# EAGLE design Arduino-Fio (EAGLE 7.6.0)

## Sheet 1 of 2
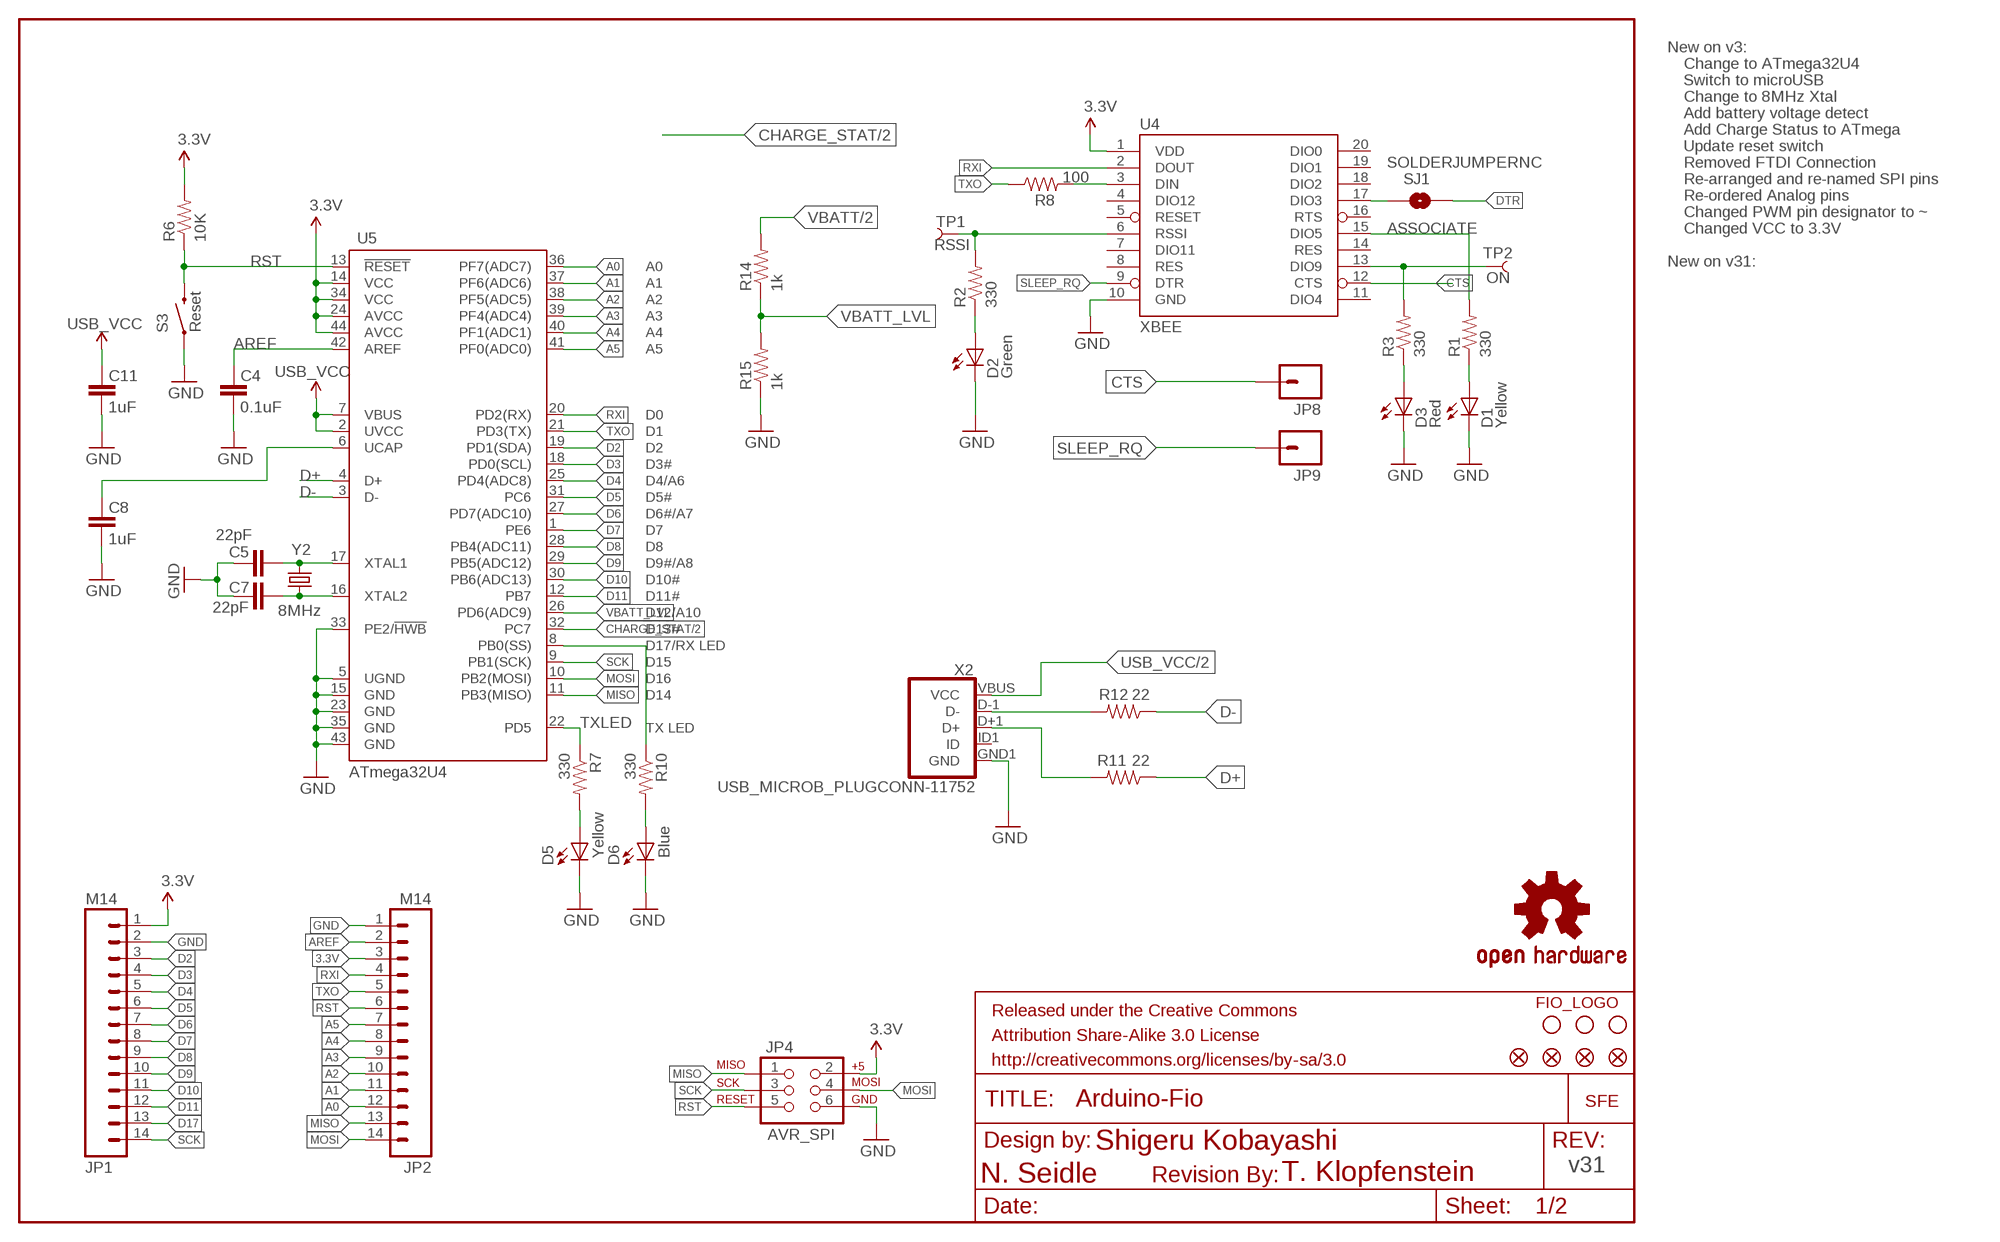
[diagram p0: schematic, sheet 1]

### Parts
C4  0.1uF  CAP0603-CAP  [0603-CAP]
C5  22pF  CAP0603-CAP  [0603-CAP]
C7  22pF  CAP0603-CAP  [0603-CAP]
C8  1uF  CAP0603-CAP  [0603-CAP]
C11  1uF  CAP0603-CAP  [0603-CAP]
D1  Yellow  LED0603  [LED-0603]
D2  Green  LED0603  [LED-0603]
D3  Red  LED0603  [LED-0603]
D5  Yellow  LED0603  [LED-0603]
D6  Blue  LED0603  [LED-0603]
FRAME1  FRAME-LETTER  [CREATIVE_COMMONS]
JP1  M14  [1X14]
JP2  M14  [1X14]
JP4  AVR_SPI  AVR_SPI_PRG_6PTH  [2X3]
JP5  STAND-OFF  [STAND-OFF]
JP8  M01PTH  [1X01]
JP9  M01PTH  [1X01]
JP10  FIDUCIALUFIDUCIAL  FIDUCIAL1X2  [FIDUCIAL-1X2]
JP11  FIDUCIALUFIDUCIAL  FIDUCIAL1X2  [FIDUCIAL-1X2]
JP12  FIDUCIALUFIDUCIAL  FIDUCIAL1X2  [FIDUCIAL-1X2]
JP13  FIDUCIALUFIDUCIAL  FIDUCIAL1X2  [FIDUCIAL-1X2]
JP16  STAND-OFF  [STAND-OFF]
JP17  STAND-OFF  [STAND-OFF]
LOGO1  OSHW-LOGOL  [OSHW-LOGO-L]
R1  330  RESISTOR0603-RES  [0603-RES]
R2  330  RESISTOR0603-RES  [0603-RES]
R3  330  RESISTOR0603-RES  [0603-RES]
R6  10K  RESISTOR0603-RES  [0603-RES]
R7  330  RESISTOR0603-RES  [0603-RES]
R8  100  RESISTOR0603-RES  [0603-RES]
R10  330  RESISTOR0603-RES  [0603-RES]
R11  22  RESISTOR0603-RES  [0603-RES]
R12  22  RESISTOR0603-RES  [0603-RES]
R14  1k  RESISTOR0603-RES  [0603-RES]
R15  1k  RESISTOR0603-RES  [0603-RES]
S3  Reset  SWITCH-MOMENTARY-2SMD  [TACTILE_SWITCH_SMD]
SJ1  SOLDERJUMPERNC  [SJ_2S]
TP1  RSSI  TEST-POINT3X5  [PAD.03X.05]
TP2  ON  TEST-POINT3X5  [PAD.03X.05]
U4  XBEE  XBEE-1B3  [XBEE-SMD]
U5  ATmega32U4  ATMEGA32U41:1  [QFN-44-NOPAD_1:1]
U$1  LOGO-SFENEW  [SFE-NEW-WEBLOGO]
U$2  REVISION  [REVISION]
U$6  FIO_LOGOV2  [FUNNEL_LOGO_BOTTOM_V2]
X2  USB_MICROB_PLUGCONN-11752  [USB-B-MICRO-SMD_V03]
Y2  8MHz  CRYSTAL5X3  [CRYSTAL-SMD-5X3]

### Nets
3.3V [vcc]: JP1.1 JP2.3 JP4.2 R6.2 U4.1(VDD) U5.14(VCC) U5.24(AVCC) U5.34(VCC) U5.44(AVCC) ; also sheet 2
A0: JP2.12 U5.36(PF7(ADC7))
A1: JP2.11 U5.37(PF6(ADC6))
A2: JP2.10 U5.38(PF5(ADC5))
A3: JP2.9 U5.39(PF4(ADC4))
A4: JP2.8 U5.40(PF1(ADC1))
A5: JP2.7 U5.41(PF0(ADC0))
AREF: C4.2 JP2.2 U5.42(AREF)
ASSOCIATE: R1.2 U4.15(DIO5)
CHARGE_STAT: U5.32(PC7) ; also sheet 2
CTS: JP8.1 U4.12(CTS)
D2: JP1.3 U5.19(PD1(SDA))
D3: JP1.4 U5.18(PD0(SCL))
D4: JP1.5 U5.25(PD4(ADC8))
D5: JP1.6 U5.31(PC6)
D6: JP1.7 U5.27(PD7(ADC10))
D7: JP1.8 U5.1(PE6)
D8: JP1.9 U5.28(PB4(ADC11))
D9: JP1.10 U5.29(PB5(ADC12))
D10: JP1.11 U5.30(PB6(ADC13))
D11: JP1.12 U5.12(PB7)
D17: JP1.13 R10.1 U5.8(PB0(SS))
D+: R11.1 U5.4(D+)
D-: R12.1 U5.3(D-)
DTR: SJ1.2
GND: C4.1 C5.2 C7.2 C8.1 C11.1 D1.C D2.C D3.C D5.C D6.C JP1.2 JP2.1 JP4.6 R15.1 S3.1 U4.10(GND) U5.5(UGND) U5.15(GND) U5.23(GND) U5.33(PE2/!HWB) U5.35(GND) U5.43(GND) X2.GND1(GND) ; also sheet 2
MISO: JP2.13 JP4.1 U5.11(PB3(MISO))
MOSI: JP2.14 JP4.4 U5.10(PB2(MOSI))
N$1: R3.2 TP2.P$1 U4.13(DIO9)
N$2: D1.A R1.1
N$3: D2.A R2.1
N$4: R2.2 TP1.P$1 U4.6(RSSI)
N$5: R11.2 X2.D+1(D+)
N$6: D3.A R3.1
N$7: R8.2 U4.3(DIN)
N$13: SJ1.1 U4.17(DIO3)
N$15: D5.A R7.2
N$16: C7.1 U5.16(XTAL2) Y2.1
N$17: C5.1 U5.17(XTAL1) Y2.3
N$19: D6.A R10.2
N$20: R12.2 X2.D-1(D-)
RST: JP2.6 JP4.5 R6.1 S3.3 U5.13(!RESET)
RXI: JP2.4 U4.2(DOUT) U5.20(PD2(RX))
SCK: JP1.14 JP4.3 U5.9(PB1(SCK))
SLEEP_RQ: JP9.1 U4.9(DTR)
TXLED: R7.1 U5.22(PD5)
TXO: JP2.5 R8.1 U5.21(PD3(TX))
UCAP: C8.2 U5.6(UCAP)
USB_VCC: C11.2 U5.2(UVCC) U5.7(VBUS) X2.VBUS(VCC) ; also sheet 2
VBATT: R14.2 ; also sheet 2
VBATT_LVL: R14.1 R15.2 U5.26(PD6(ADC9))
Unconnected: U4.4(DIO12) U4.5(RESET) U4.7(DIO11) U4.8(RES) U4.11(DIO4) U4.14(RES) U4.16(RTS) U4.18(DIO2) U4.19(DIO1) U4.20(DIO0) X2.ID1(ID)

### Notes on the sheet
- New on v3:
- Change to ATmega32U4
- Switch to microUSB
- Change to 8MHz Xtal
- Add battery voltage detect
- Add Charge Status to ATmega
- Update reset switch
- Removed FTDI Connection
- Re-arranged and re-named SPI pins
- Re-ordered Analog pins
- Changed PWM pin designator to ~
- Changed VCC to 3.3V
- New on v31:
- Shigeru Kobayashi
- v31
- N. Seidle | T. Klopfenstein

## Sheet 2 of 2
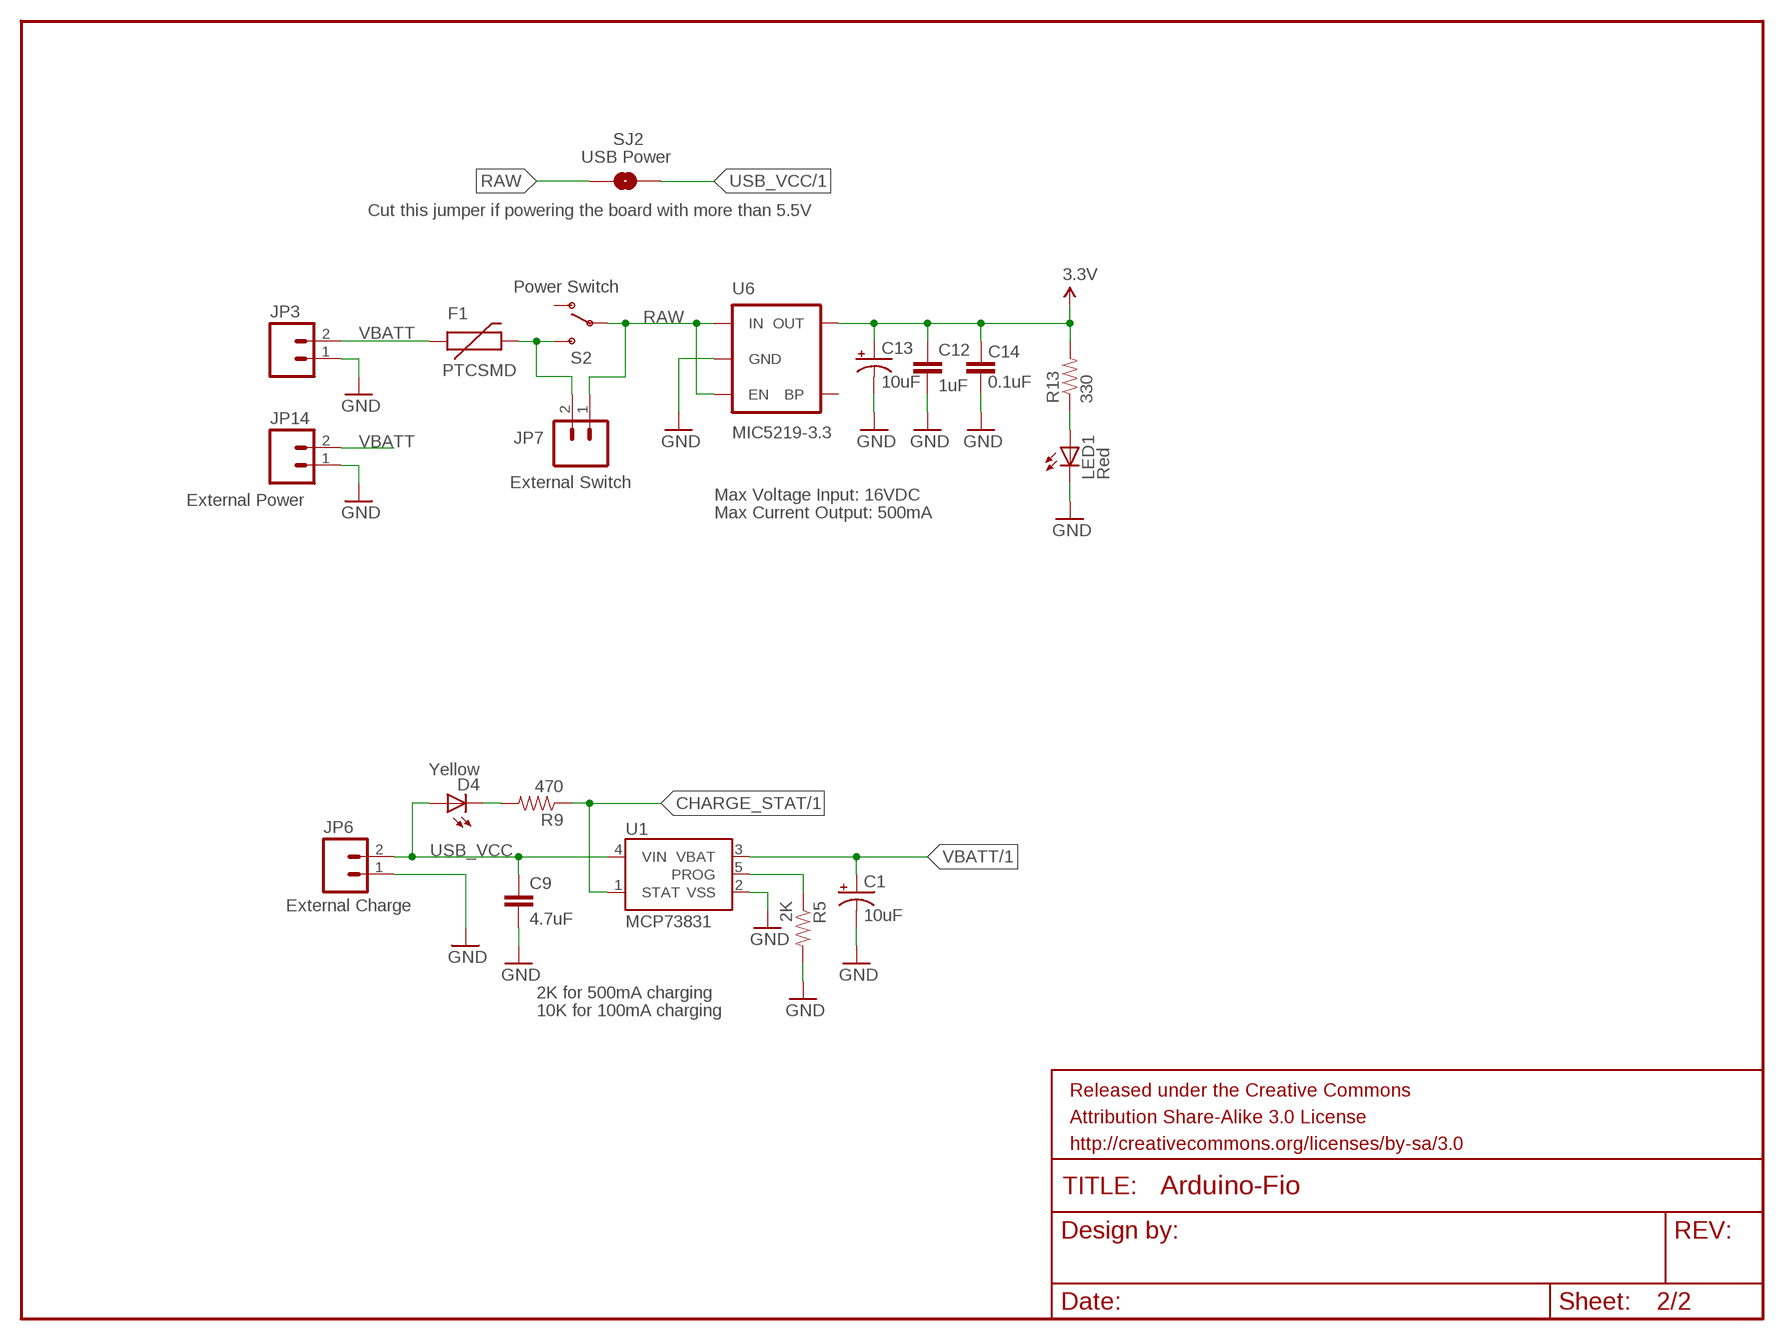
[diagram p1: schematic, sheet 2]

### Parts
C1  10uF  CAP_POL1206  [EIA3216]
C9  4.7uF  CAP0603-CAP  [0603-CAP]
C12  1uF  CAP0603-CAP  [0603-CAP]
C13  10uF  CAP_POL1206  [EIA3216]
C14  0.1uF  CAP0603-CAP  [0603-CAP]
D4  Yellow  LED0603  [LED-0603]
F1  PTCSMD  [PTC-1206]
FRAME2  FRAME-LETTER  [CREATIVE_COMMONS]
JP3  M02-JST-2MM-SMT  [JST-2-SMD]
JP6  External Charge  M02PTH  [1X02]
JP7  External Switch  M02PTH  [1X02]
JP14  External Power  M02PTH  [1X02]
LED1  Red  LED0603  [LED-0603]
R5  2K  RESISTOR0603-RES  [0603-RES]
R9  470  RESISTOR0603-RES  [0603-RES]
R13  330  RESISTOR0603-RES  [0603-RES]
S2  Power Switch  SWITCH-SPSTSMD  [AYZ0202]
SJ2  USB Power  SOLDERJUMPERTRACE  [SJ_2S-TRACE]
U1  MCP73831  [SOT23-5]
U6  MIC5219-3.3  V_REG_LDOSMD  [SOT23-5]

### Nets
3.3V [vcc]: C12.1 C13.A(+) C14.2 R13.2 U6.5(OUT) ; also sheet 1
CHARGE_STAT: R9.1 U1.1(STAT) ; also sheet 1
GND: C1.C(-) C9.2 C12.2 C13.C(-) C14.1 JP3.1 JP6.1 JP14.1 LED1.C R5.2 U1.2(VSS) U6.2(GND) ; also sheet 1
N$8: D4.C R9.2
N$9: F1.2 JP7.2 S2.3(S)
N$11: R5.1 U1.5(PROG)
N$38: LED1.A R13.1
RAW [vcc]: JP7.1 S2.2(P) SJ2.1 U6.1(IN) U6.3(EN)
USB_VCC: C9.1 D4.A JP6.2 SJ2.2 U1.4(VIN) ; also sheet 1
VBATT: C1.A(+) F1.1 JP3.2 JP14.2 U1.3(VBAT) ; also sheet 1
Unconnected: S2.1(O) U6.4(BP)

### Notes on the sheet
- Cut this jumper if powering the board with more than 5.5V
- Max Voltage Input: 16VDC
- Max Current Output: 500mA
- 2K for 500mA charging
- 10K for 100mA charging

## Library data of the parts
C1 C13 = SparkFun:CAP_POL: Capacitor Polarized These are standard SMD and PTH capacitors. Normally 10uF, 47uF, and 100uF in electrolytic and tantalum varieties. Always verify the external diameter of the through hole cap, it varies with capacity, voltage, and manufacturer. The EIA devices should be standard.
C4 C5 C7-C9 C11 C12 C14 = SparkFun-Capacitors:CAP: Capacitor Standard 0603 ceramic capacitor, and 0.1" leaded capacitor.
D1-D6 LED1 = SparkFun:LED: LEDs Standard schematic elements and footprints for 5mm, 3mm, 1206, and 0603 sized LEDs. 5mm - Spark Fun Electronics SKU : COM-00529 (and others)
F1 = SparkFun:PTC: Resettable Fuse PTC Resettable Fuse. Spark Fun Electronics SKU : COM-08357
FRAME1 FRAME2 = SparkFun-Aesthetics:FRAME-LETTER: Schematic Frame Standard 8.5x11 US Letter frame
JP1 JP2 = SparkFun:M14: Header 14 Standard 14-pin 0.1" header. Use with straight break away headers (SKU : PRT-00116), right angle break away headers (PRT-00553), swiss pins (PRT-00743), machine pins (PRT-00117), and female headers (PRT-00115).
JP3 JP6 JP7 JP14 = SparkFun:M02: Header 2 Standard 2-pin 0.1" header. Use with straight break away headers (SKU : PRT-00116), right angle break away headers (PRT-00553), swiss pins (PRT-00743), machine pins (PRT-00117), and female headers (PRT-00115). Molex polarized connector foot print use with SKU : PRT-08233 with associated crimp pins and housings.
JP4 = SparkFun:AVR_SPI_PRG_6: AVR ISP 6 Pin This is the reduced ISP connector for AVR programming. Common on Arduino. This footprint will take up less PCB space and can be used with a 10-pin to 6-pin adapter such as SKU: BOB-08508
JP5 JP16 JP17 = SparkFun:STAND-OFF: Stand Off This is the mechanical footprint for a #4 phillips button head screw. Use the keepout ring to avoid running the screw head into surrounding components. SKU : PRT-00447
JP8 JP9 = SparkFun:M01: Header 1 Standard 1-pin 0.1" header. Use with straight break away headers (SKU : PRT-00116), right angle break away headers (PRT-00553), swiss pins (PRT-00743), machine pins (PRT-00117), and female headers (PRT-00115).
JP10-JP13 = SparkFun:FIDUCIAL: Fiducial Alignment Points Various fiducial points for machine vision alignment.
LOGO1 = SparkFun-Aesthetics:OSHW-LOGO: Open Source Hardware Logo This logo indicates the piece of hardware it is found on incorporates a OSHW license and/or adheres to the definition of open source hardware found here: http://freedomdefined.org/OSHW
R1-R3 R5-R15 = SparkFun-Resistors:RESISTOR: Resistor Basic schematic elements and footprints for 0603, 1206, and PTH resistors.
S2 = SparkFun:SWITCH-SPST: SPST Switch Simple slide switch. Spark Fun Electronics SKU : COM-00102
S3 = SparkFun:SWITCH-MOMENTARY-2
SJ1 SJ2 = SparkFun:SOLDERJUMPER: Solder Jumper Standard SMD solder jumper. Used to automate production. Two varients : Normally Open and Normally Closed are the same, but have different paste layers. NC will have a large amount of paste and should jumper during reflow.
TP1 TP2 = SparkFun:TEST-POINT
U1 = SparkFun:MCP73831: Microchip's MCP73831 Miniature single cell, fully integrated Li-Ion, Li-polymer charge management controller http://ww1.microchip.com/downloads/en/DeviceDoc/21984a.pdf
U4 = SparkFun:XBEE-1
U5 = SparkFun-IC-Microcontroller:ATMEGA32U4: Atmel MCU, 32KByte Atmel 44-pin 8-bit Microcontroller with 32KBytes of ISP Flash and USB Controller Datasheet <http://cdn.sparkfun.com/datasheets/Dev/Arduino/Boards/ATMega32U4.pdf> SparkFun Products LilyPad Arduino USB - ATmega32U4 Board <https://www.sparkfun.com/products/12049> (DEV-12049) Pro Micro - 5V/16MHz <https://www.sparkfun.com/products/12640> (DEV-12640) Pro Micro - 3.3V/8MHz <https://www.sparkfun.com/products/12587> (DEV-12587) Fio v3 - ATmega32U4 <https://www.sparkfun.com/products/11520> (DEV-11520) Qduino Mini <https://www.sparkfun.com/products/13614> (DEV-13614) Makey Makey - Standard Kit <https://www.sparkfun.com/products/11511> (WIG-11511) Makey Makey Deluxe Kit <https://www.sparkfun.com/products/11519> (WIG-11519); PROD_ID: IC-10828; VALUE: 32U4
U6 = SparkFun:V_REG_LDO: Voltage Regulator LDO Standard 150mA LDO voltage regulator in SOT-23 layout. Micrel part MIC5205. BP (by-pass) pin is used to lower output noise with 470pF cap.
U$1 = SparkFun:LOGO-SFE: Spark Fun Electronics PCB Logo This is the standard Spark Fun Electronics PCB logo.
U$2 = SparkFun-Aesthetics:REVISION
U$6 = SparkFun:FIO_LOGO
X2 = SparkFun-Connectors:USB_MICROB_PLUG: USB Micro-B Plug Comes in a variety of packages. Check out Hirose's ZX-x0 line: http://www.hirose.co.jp/cataloge_hp/e24200011.pdf; PROD_ID: CONN-11752
Y2 = SparkFun:CRYSTAL: Crystals Various standard crystals. Proven footprints. Spark Fun Electronics SKU : COM-00534

## Net classes
0 Default: width 0.203 mm
2 LEDPower: width 0.203 mm
3 ButtonSignal: width 0.203 mm

## Board
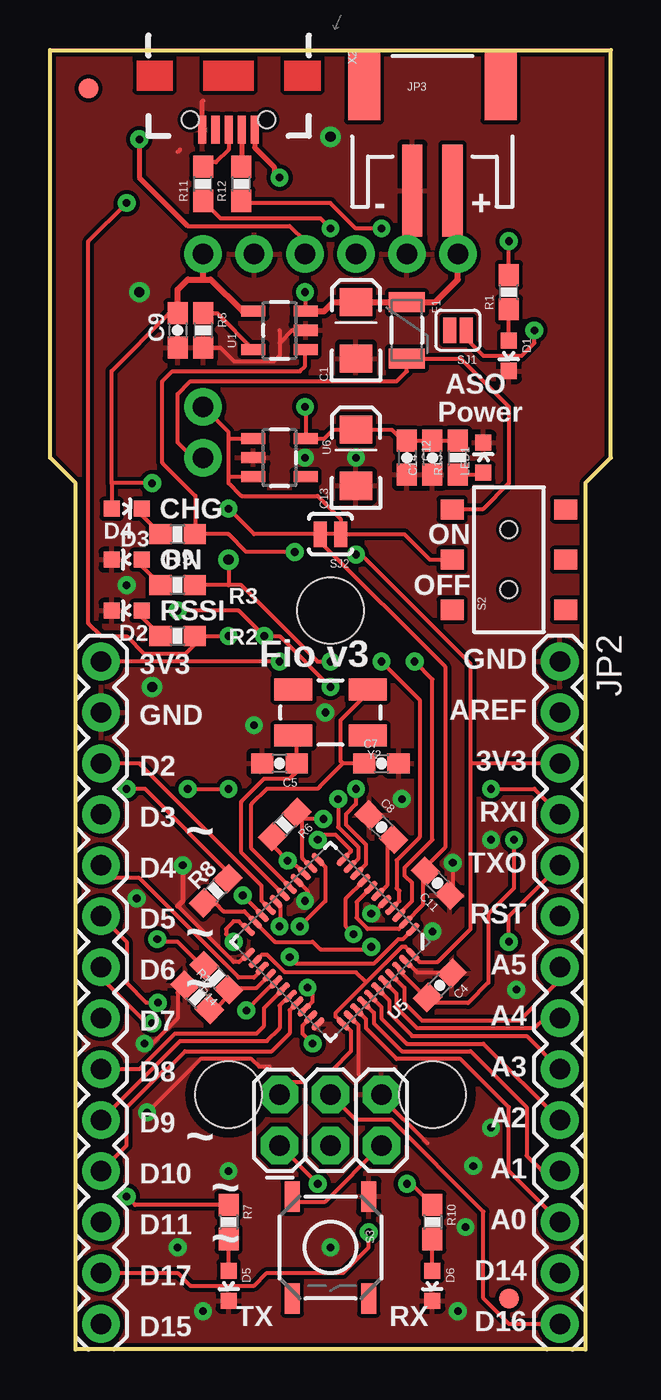
[diagram p2: board, top side]
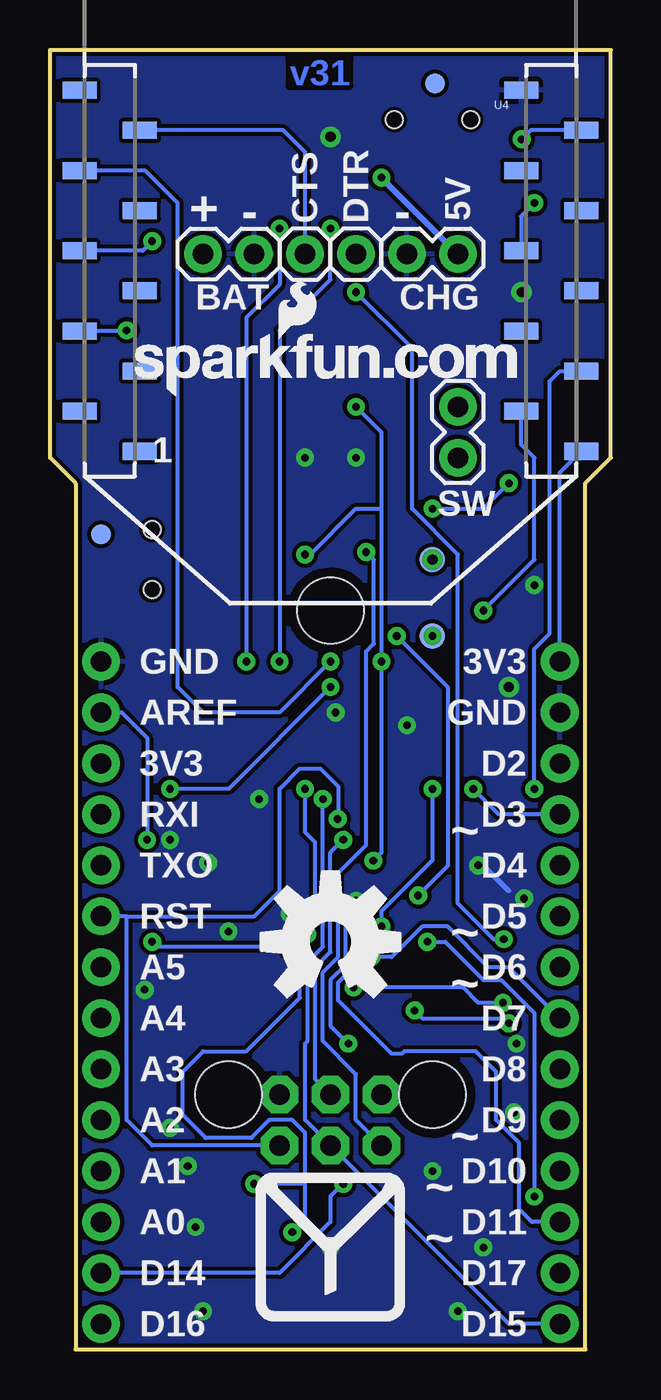
[diagram p3: board, bottom side, seen from below]

Size 27.94 x 64.77 mm. Coordinates in mm from the lower left corner, seen from the top.
Outline: 26.67,43.18 26.67,0 1.27,0 1.27,43.18 0,44.45 0,64.77 27.94,64.77 27.94,44.45 26.67,43.18
Copper layers (1*16): Top 0.035mm / dielectric 1.5mm / Bottom 0.035mm
Design rules "SparkFun *": minimum track width 7mil, minimum drill 15mil, track to track 5mil, track to pad 5mil, pad to pad 5mil, via to via 5mil, smd to smd 5mil, copper to edge 8mil, drill to drill 8mil, minimum pad ring 12mil, minimum via ring 10mil, stop-mask expansion 4mil, vias tented up to drill 20mil, thermal gap 10mil

### Footprints (pad centres in the part's own frame; a part is rotated, then mirrored left to right if it is on the bottom)
EIA3216 = smd 1.4 x 1.6: A 1.4,0; C -1.4,0
0603-CAP = smd 1.1 x 1: 1 -0.85,0; 2 0.85,0
LED-0603 = smd 0.8 x 0.8: A 0,-0.75; C 0,0.75
PTC-1206 = smd 1 x 1.8: 1 -1.4,0; 2 1.4,0
1X14 = drill 1.016 pad 1.88: 1 0,0; 2 2.54,0; 3 5.08,0; 4 7.62,0; 5 10.16,0; 6 12.7,0; 7 15.24,0; 8 17.78,0; 9 20.32,0; 10 22.86,0; 11 25.4,0; 12 27.94,0; 13 30.48,0; 14 33.02,0
JST-2-SMD = smd 1 x 4.6: 1 -1,-3.7; 2 1,-3.7 | smd 1.6 x 3.4: NC1 -3.4,1.5; NC2 3.4,1.5
2X3 = drill 1.016 pad 1.88 octagon: 1 0,0; 2 0,2.54; 3 2.54,0; 4 2.54,2.54; 5 5.08,0; 6 5.08,2.54
STAND-OFF = hole 3.302: 0,0
1X02 = drill 1.016 pad 1.88: 1 0,0; 2 2.54,0
1X01 = drill 1.016 pad 1.88: 1 0,0
FIDUCIAL-1X2 = smd 1 x 1: 1 0,0
0603-RES = smd 1.1 x 1: 1 -0.85,0; 2 0.85,0
AYZ0202 = smd 1 x 1.15: 1 -2.5,2.825; 2 0,2.825; 3 2.5,2.825; 4 -2.5,-2.825; 5 0,-2.825; 6 2.5,-2.825 | hole 0.85: 1.5,0; -1.5,0
TACTILE_SWITCH_SMD = smd 1.524 x 0.762: 1 -2.54,1.905; 2 2.54,1.905; 3 -2.54,-1.905; 4 2.54,-1.905
SJ_2S = smd 0.635 x 1.27: 1 -0.412,0; 2 0.412,0
SJ_2S-TRACE = smd 0.635 x 1.27: 1 -0.508,0; 2 0.508,0
PAD.03X.05 = smd 1.27 x 1.27: P$1 0,0
SOT23-5 = smd 0.55 x 1.2: 1 -0.95,-1.3; 2 0,-1.3; 3 0.95,-1.3; 4 0.95,1.3; 5 -0.95,1.3
XBEE-SMD = smd 1.7 x 0.85: 1 -12.5,20; 2 -9.5,18; 3 -12.5,16; 4 -9.5,14; 5 -12.5,12; 6 -9.5,10; 7 -12.5,8; 8 -9.5,6; 9 -12.5,4; 10 -9.5,2; 11 12.5,2; 12 9.5,4; 13 12.5,6; 14 9.5,8; 15 12.5,10; 16 9.5,12; 17 12.5,14; 18 9.5,16; 19 12.5,18; 20 9.5,20
QFN-44-NOPAD_1:1 = smd 0.8 x 0.3: 1 -3.337,2.458; 2 -3.337,1.958; 3 -3.337,1.479; 4 -3.337,0.979; 5 -3.337,0.5; 6 -3.337,0; 7 -3.337,-0.5; 8 -3.337,-0.979; 9 -3.337,-1.479; 10 -3.337,-1.958; 11 -3.337,-2.458; 23 3.337,-2.458; 24 3.337,-1.958; 25 3.337,-1.479; 26 3.337,-0.979; 27 3.337,-0.5; 28 3.337,0; 29 3.337,0.5; 30 3.337,0.979; 31 3.337,1.479; 32 3.337,1.958; 33 3.337,2.458 | smd 0.3 x 0.8: 12 -2.458,-3.337; 13 -1.958,-3.337; 14 -1.479,-3.337; 15 -0.979,-3.337; 16 -0.5,-3.337; 17 0,-3.337; 18 0.5,-3.337; 19 0.979,-3.337; 20 1.479,-3.337; 21 1.958,-3.337; 22 2.458,-3.337; 34 2.458,3.337; 35 1.958,3.337; 36 1.479,3.337; 37 0.979,3.337; 38 0.5,3.337; 39 0,3.337; 40 -0.5,3.337; 41 -0.979,3.337; 42 -1.479,3.337; 43 -1.958,3.337; 44 -2.458,3.337
USB-B-MICRO-SMD_V03 = smd 1.4 x 0.4: D+1 2.7,0; D-1 2.7,0.65; GND1 2.7,-1.3; ID1 2.7,-0.65; VBUS 2.7,1.3 | hole 0.85: 2.2,1.9; 2.2,-1.9
CRYSTAL-SMD-5X3 = smd 1.9 x 1.1: 1 -1.85,-1.15; 2 1.85,-1.15; 3 1.85,1.15; 4 -1.85,1.15

### Placement (x,y rotation side)
C1  15.24,50.8 90 top
C4  19.41,18.14 225 top
C5  11.43,29.21 180 top
C7  16.51,29.21 0 top
C8  16.51,26.04 315 top
C9  6.35,50.8 270 top
C11  19.3,23.24 135 top
C12  17.78,44.45 270 top
C13  15.24,44.45 90 top
C14  19.05,44.45 90 top
D1  22.86,49.53 180 top
D2  3.81,36.83 90 top
D3  3.81,39.37 90 top
D4  3.81,41.91 270 top
D5  8.89,3.17 180 top
D6  19.05,3.17 180 top
F1  17.78,50.8 270 top
FRAME1  1.8,-11.43 0 top  (outside the outline)
FRAME2  1.91,-11.43 0 top  (outside the outline)
JP1  2.54,34.29 270 top
JP2  25.4,34.29 270 top
JP3  19.05,61.47 0 top
JP4  11.43,10.16 0 top
JP5  8.89,12.7 0 top
JP6  10.16,54.61 0 bottom
JP7  7.62,46.99 270 bottom
JP8  15.24,54.61 0 bottom
JP9  12.7,54.61 0 bottom
JP10  22.86,2.54 0 top
JP11  1.91,62.87 0 top
JP12  8.76,63.12 0 bottom
JP13  25.4,40.64 0 bottom
JP14  17.78,54.61 180 bottom
JP16  13.97,36.83 0 top
JP17  19.05,12.7 0 top
LED1  21.59,44.45 0 top
LOGO1  13.97,20.32 0 bottom
R1  22.86,52.7 90 top
R2  6.35,35.56 0 top
R3  6.35,38.1 0 top
R5  7.62,50.8 270 top
R6  11.68,26.16 225 top
R7  8.89,6.35 270 top
R8  8.26,22.86 45 top
R9  6.35,40.64 180 top
R10  19.05,6.35 270 top
R11  7.62,58.1 90 top
R12  9.53,58.1 90 top
R13  20.32,44.45 90 top
R14  8.29,18.53 135 top
R15  7.33,17.55 315 top
S2  22.86,39.37 90 top
S3  13.97,5.08 270 top
SJ1  20.32,50.8 180 top
SJ2  13.97,40.64 180 top
TP1  8.89,35.56 0 bottom
TP2  8.89,39.37 0 bottom
U1  11.43,50.8 90 top
U4  13.97,64.77 180 bottom
U5  13.97,20.32 225 top
U6  11.43,44.45 270 top
U$1  23.75,47.5 0 bottom
U$2  13.97,-15.24 0 top  (outside the outline)
U$6  13.97,5.08 0 top
X2  8.89,63.5 270 top
Y2  13.97,31.75 180 top

### Tracks (layer width: path | path; a pad name or v marks a point on that pad's centre or on a via)
3.3V  (via drill 0.38)
  Top 0.203: R13.2 C14.2 C12.1 17.58,45.3 17.03,45.85 C13.A 14.1,45.85 13.65,45.4 U6.5 12.73,46.96 v12.7,46.99 | v11.43,34.29 JP1.1 | JP4.2 12.06,13.34 12.7,13.34 13.33,13.97 14.1,13.97 14.99,14.86 14.99,15.88 14.73,16.13 14.62,16.13 14.59,16.16 U5.34 14.22,16.59 14.22,16.76 15.75,18.29 | 16.65,19.19 17.53,20.07 17.7,20.07 U5.44 18.07,19.65 18.41,19.3 19.3,19.3 20.95,20.95 20.95,29.21 | 16.65,19.19 | 15.75,18.29 16.65,19.19 | 15.75,18.29 15.24,18.8 11.68,18.8 10.79,19.68 10.57,19.68 U5.24 | U5.14 12.02,24.36 v11.84,24.36 11.08,25.11 R6.2 | v15.24,39.62 15.49,39.62 20.95,34.16 20.95,29.21 | JP2.3 20.95,29.21
  Bottom 0.203: JP1.1 2.54,43.7 U4.1 | v12.7,46.99 11.43,45.72 11.43,41.91 | 11.43,41.91 v11.43,34.29 11.43,24.77 v11.84,24.36 | v15.24,39.62 14.99,39.62 12.7,41.91 11.43,41.91
A0
  Top 0.203: JP2.12 22.86,8.89 22.86,12.06 20.45,14.48 17.27,14.48 15.75,16 15.75,16.45 U5.36
A1
  Top 0.203: JP2.11 24.51,8.89 23.75,9.65 23.75,12.06 20.95,14.86 17.53,14.86 16.13,16.26 16.13,16.78 U5.37
A2
  Top 0.203: JP2.10 21.59,15.24 17.78,15.24 16.51,16.51 16.51,17.07 U5.38 | U5.38
A3
  Top 0.203: JP2.9 23.75,15.62 18.03,15.62 16.89,16.76 16.89,17.4 U5.39 | U5.39
A4
  Top 0.203: JP2.8 24.64,16.51 24.13,16 18.29,16 17.27,17.02 17.27,17.73 U5.40 | U5.40
A5
  Top 0.203: U5.41 17.65,18.02 17.65,17.27 18.54,16.38 23.37,16.38 25.4,18.41 JP2.7
AREF  (via drill 0.38)
  Top 0.203: U5.42 17.38,18.89 18.77,17.5 C4.2 19.09,17.27 20.83,17.27 21.84,18.29 21.84,21.72 23.11,22.99 v23.11,25.4
  Bottom 0.203: JP2.2 24.38,31.75 23.11,30.48 v23.11,25.4
ASSOCIATE  (via drill 0.38)
  Top 0.203: R1.2 v22.86,55.24
  Bottom 0.203: U4.15 23.34,54.77 v22.86,55.24
CHARGE_STAT  (via drill 0.38)
  Top 0.203: U5.32 12.99,16.52 12.96,16.52 12.57,16.13 12.57,15.75 v13.08,15.24 | v12.19,39.75 9.78,39.75 8.89,40.64 R9.1 7.24,40.68 7.24,42.55 5.59,44.2 5.59,48.26 6.1,48.77 12.45,48.77 12.7,49.02 12.7,49.82 U1.1
  Bottom 0.203: v13.08,15.24 13.97,16.13 13.97,18.41 13.21,19.18 13.21,21.97 13.59,22.35 13.59,23.75 12.19,25.15 12.19,34.8 11.81,35.18 11.81,39.37 v12.19,39.75
CTS
  Bottom 0.203: U4.12 16.32,60.77 15.24,59.69 JP8.1
D2
  Top 0.203: JP1.3 4.45,29.21 10.54,23.11 10.54,22.36 U5.19
D3  (via drill 0.38)
  Top 0.203: v6.86,27.94 v8.89,27.94 | U5.18 11.33,22.33 | U5.18 11.34,22.33 | 11.47,21.4 11.43,21.36 v11.43,21.08 11.47,21.12 11.47,22.11 U5.18
  Bottom 0.203: v6.86,27.94 5.59,26.67 JP1.4 | v8.89,27.94 8.89,24.38 11.43,21.84 v11.43,21.08
D4
  Top 0.203: U5.25 10.56,18.95 10.16,18.54 9.4,18.54 4.45,23.5 3.17,23.5 JP1.5
D5  (via drill 0.38)
  Top 0.203: 12.95,17.91 v12.83,18.03 13.08,17.78 13.08,17.34 U5.31 | JP1.6 3.81,20.32 3.81,18.26 4.79,17.28 v5.37,17.28
  Bottom 0.203: v5.37,17.28 6.61,17.28 7.37,18.03 v12.83,18.03
D6  (via drill 0.38 pad 0.41)
  Top 0.203: U5.27 11.2,18.31 v9.78,16.89 | v5.08,16.26 4.81,16.26 2.57,18.5 2.57,19.02 JP1.7
  Bottom 0.203: 5.33,16.38 5.21,16.38 v5.08,16.26 5.33,16.51 9.4,16.51 v9.78,16.89
D7  (via drill 0.38)
  Top 0.203: v11.94,19.56 12.24,19.25 16.15,19.25 17.35,20.45 17.57,20.45 U5.1
  Bottom 0.203: JP1.8 5.08,19.05 6.1,19.05 8.13,21.08 9.4,21.08 10.92,19.56 v11.94,19.56
D8
  Top 0.203: JP1.9 4.45,13.97 6.22,15.75 10.29,15.75 10.67,16.13 10.67,17.02 U5.28
D9
  Top 0.203: U5.29 11.89,17.61 11.43,17.14 11.43,16 10.79,15.37 6.48,15.37 JP1.10
D10
  Top 0.203: JP1.11 3.81,10.16 3.81,12.06 5.71,13.97 5.84,13.97 6.73,14.86 11.05,14.86 11.94,15.75 11.94,16.9 U5.30
D11  (via drill 0.38)
  Top 0.203: v12.45,21.08 13.72,22.35 13.72,24.05 U5.12
  Bottom 0.203: JP1.12 3.94,6.35 4.57,6.99 4.57,10.29 5.71,11.43 5.71,13.84 6.73,14.86 10.29,14.86 10.41,14.73 10.92,14.73 13.59,17.4 13.59,18.29 12.7,19.18 12.7,20.83 v12.45,21.08
D17  (via drill 0.38)
  Top 0.203: v15.11,20.7 14.73,21.08 14.73,22.48 15.67,23.41 15.67,23.4 U5.8 | JP1.13 6.35,3.81 6.98,3.17 10.16,3.17 10.79,3.81 14.61,3.81 15.88,5.08 v15.88,5.84 | v17.78,8.26 18,8.26 R10.1
  Bottom 0.203: 15.24,8.26 15.24,10.79 15.88,11.43 17.02,11.43 17.91,10.54 20.19,10.54 21.34,11.68 21.34,13.84 20.32,14.86 18.16,14.86 15.49,17.53 15.49,19.56 15.24,19.81 15.24,20.57 v15.11,20.7 | 15.24,8.26 v17.78,8.26 | v15.88,5.84 15.75,5.84 15.24,6.35 15.24,8.26
D+  (via drill 0.38)
  Top 0.203: v16.51,34.29 18.41,32.38 18.41,25.53 17.27,24.38 17.27,22.99 17.4,22.86 17.4,22.35 17.03,21.99 U5.4 | v13.97,55.88 13.46,56.39 8.48,56.39 R11.1
  Bottom 0.203: v13.97,55.88 13.97,53.34 16.51,50.8 v16.51,34.29
D-  (via drill 0.38 pad 0.41)
  Top 0.203: U5.3 17.38,21.69 18.03,22.35 18.03,23.24 17.65,23.62 17.65,24 19.05,25.4 19.05,33.4 v18.16,34.29 | v16.51,55.88 15.24,55.88 13.97,57.15 9.63,57.15 R12.1
  Bottom 0.203: v16.51,55.88 16.51,53.09 18.16,51.44 v18.16,34.29
GND  (via drill 0.38, 0.38 pad 0.41, 0.51)
  Top 0.203: 6.35,22.1 9.14,19.3 9.42,19.3 9.81,19.7 U5.23 | 15.37,13.72 15.37,16.15 U5.35 | JP4.6 16.51,12.57 18.8,10.29 | 10.92,14.1 10.41,14.1 10.03,14.48 7.49,14.48 v4.83,11.81 | U5.5 16.07,21.72 v16,21.72 | 20.07,18.8 C4.1 19.97,18.8 18.29,18.8 17.74,19.34 U5.43 | 6.73,18.67 R15.1 6.35,17.78 6.35,16.51 5.08,15.24 v4.7,15.24 | 19.94,22.67 C11.1 20.07,22.8 v20.07,24.26 | U1.2 12.06,50.8 11.43,50.16 | U5.15 12.83,22.85 12.83,22.48 v12.7,22.35 | R5.2 8.47,49.95 9.14,49.28 11.18,49.28 11.43,49.53 11.43,50.8 | 6.48,59.82 6.35,59.69
  Top 0.254: X2.GND1 7.59,62.2 7.62,62.23 | v6.6,24.13 6.6,22.35 6.35,22.1
  Bottom 0.254: v6.6,24.13 6.35,24.13 5.08,22.86
  other vias: 17.53,27.43 13.97,5.08 20.32,1.91 7.62,1.91 21.97,11.05 23.23,17.93 19.05,20.83 15.24,44.45 12.7,44.45 3.81,38.1 13.72,31.75 10.16,31.11 20.7,6.1 8.89,8.89 6.35,5.08 21.08,9.14 4.32,22.48 13.97,60.45 4.45,52.7 5.08,33.02 21.97,25.4
  pour Top (isolate 0.203): 0,64.77 27.94,64.77 27.94,0 0,0
  pour Bottom (isolate 0.203): 0,64.77 27.94,64.77 27.94,0 0,0
MISO  (via drill 0.38)
  Top 0.203: U5.11 14.99,24.81 14.99,24.89 14.22,25.65 13.59,25.65 v13.33,25.4 | JP4.1 v13.33,8.26
  Bottom 0.203: JP4.1 12.7,11.43 12.7,13.72 14.35,15.37 14.35,18.8 13.59,19.56 13.59,21.72 13.97,22.1 13.97,24.77 v13.33,25.4 | JP2.13 16.51,3.81 13.97,6.35 13.97,7.62 v13.33,8.26
MOSI  (via drill 0.38)
  Top 0.203: JP4.4 15.24,11.43 17.02,11.43 21.59,6.86 21.59,2.54 22.86,1.27 JP2.14 | v14.35,27.43 14.35,26.04 15.37,25.02 15.37,24.49 U5.10
  Bottom 0.203: v14.35,27.43 14.35,21.84 13.97,21.46 13.97,19.81 14.73,19.05 14.73,13.46 JP4.4
N$1  (via drill 0.38, 0.51)
  Top 0.203: v13.97,34.29 13.33,34.29 9.53,38.1 8.89,38.1 | 8.89,38.1 R3.2 | TP2.P$1 8.89,38.1
  Bottom 0.203: U4.13 23.21,58.77 21.59,57.15 21.59,33.02 20.32,31.75 16.51,31.75 v13.97,34.29
  other vias: 8.89,39.37
N$2
  Top 0.203: D1.A R1.1
N$3
  Top 0.203: D2.A 4.56,36.5 R2.1
N$4  (via drill 0.38)
  Top 0.203: TP1.P$1 R2.2 7.2,35.14 6.73,34.67 4.7,34.67 3.81,35.56 2.54,35.56 1.91,36.2 1.91,55.24 v3.81,57.15
  Bottom 0.203: U4.6 4.47,56.49 v3.81,57.15
  other vias: 8.89,35.56
N$5
  Top 0.203: X2.D+1 8.89,59.82 8.26,59.18 7.85,59.18 R11.2
N$6
  Top 0.203: D3.A 4.56,39.04 R3.1
N$7  (via drill 0.38)
  Top 0.203: v3.81,27.94 4.73,27.94 8.86,23.81 R8.2
  Bottom 0.203: v3.81,27.94 3.81,34.92 3.05,35.69 3.05,48.26 2.54,48.77 U4.3
N$8
  Top 0.203: D4.C 4.56,41.58 R9.2
N$9
  Top 0.203: S2.3 21.55,41.87 22.86,43.18 22.86,46.99 20.45,49.4 F1.2 17.78,48.77 17.27,48.26 6.98,48.26 6.35,47.62 6.35,45.21 7.11,44.45 JP7.2
N$11
  Top 0.203: R5.1 8.33,51.65 U1.5
N$13  (via drill 0.38)
  Top 0.203: SJ1.1 20.73,50.39 21.59,49.53 23.5,49.53 24.13,50.16 v24.13,50.8
  Bottom 0.203: v24.13,50.8 24.1,50.77 U4.17
N$15
  Top 0.203: D5.A R7.2
N$16
  Top 0.203: C7.1 14.59,29.21 | 14.59,29.21 13.45,28.07 13.45,28.05 13.33,27.94 10.79,27.94 10.03,27.18 10.03,24.96 U5.16 | 14.59,29.21 14.48,29.32 14.48,31.37 15.82,32.71 Y2.1 15.82,32.46 | U5.16
N$17
  Top 0.203: Y2.3 12.28,30.44 C5.1 12.28,28.79 11.94,28.45 10.67,28.45 9.53,27.3 9.53,24.77 U5.17 | U5.17
N$19
  Top 0.203: D6.A R10.2
N$20
  Top 0.203: 9.54,58.97 R12.2
  Top 0.254: X2.D-1 9.54,58.97
N$38
  Top 0.203: 21.49,43.8 LED1.A 21.49,43.6 R13.1
RAW
  Top 0.203: S2.2 18.92,39.37 17.65,40.64 SJ2.1 14.48,41.4 13.33,42.55 9.53,42.55 8.89,43.18 8.89,43.56 | 8.89,43.56 8.89,45.47 | 8.89,45.47 8.89,45.72 JP7.1 | U6.1 8.96,45.4 8.89,45.47 | U6.3 8.95,43.5 8.89,43.56
RST  (via drill 0.38)
  Top 0.203: U5.13 12.57,24.49 12.57,26.48 | 12.57,26.48 R6.1 | 12.57,26.48 12.57,26.54 | 12.57,26.48 13.58,26.48 v13.61,26.44 | 12.32,7.37 13.72,7.37 JP4.5
  Top 0.254: 12.32,7.37 S3.3
  Bottom 0.203: 24.13,21.59 JP2.6 | 24.13,21.59 17.78,21.59 16.51,22.86 16.51,27.94 15.49,28.96 14.48,28.96 13.59,28.07 13.59,26.47 v13.61,26.44 | 24.13,21.59 24.13,11.43 22.86,10.16 JP4.5
RXI  (via drill 0.38)
  Top 0.203: JP2.4 24.13,27.94 v21.97,27.94 | v6.35,36.83 9.4,36.83 v10.67,35.56 11.43,35.56 v13.97,33.02 | U5.20 10.56,21.67 v9.6,22.63
  Bottom 0.203: U4.2 4.47,45.11 3.81,44.45 3.81,39.37 v6.35,36.83 | v21.97,27.94 19.05,27.94 v13.97,33.02 | v10.67,35.56 8.13,33.02 8.13,24.11 v9.6,22.63
SCK  (via drill 0.38)
  Top 0.203: v15.24,27.94 15.24,27.18 14.73,26.67 14.73,26.16 15.75,25.15 15.75,24.19 U5.9
  Bottom 0.203: JP1.14 5.08,1.27 JP4.3 15.24,11.43 15.24,15.24 15.11,15.37 15.11,19.3 14.35,20.07 14.35,21.21 14.73,21.59 14.73,25.27 15.24,25.78 v15.24,27.94
SLEEP_RQ  (via drill 0.38)
  Top 0.203: 6.86,56.01 11.94,56.01 12.7,55.24 JP9.1
  Top 0.254: 6.86,56.01 4.45,58.42 v4.45,60.33
  Bottom 0.203: U4.9 4,60.77 v4.45,60.33
TXLED  (via drill 0.38)
  Top 0.203: v9.14,20.32 8.76,20.7 8.76,20.95 9.14,21.34 9.4,21.34 9.79,20.94 U5.22 | R7.1 4.23,7.2 v3.81,7.62
  Bottom 0.203: v3.81,7.62 3.81,16.76 5.46,18.41 6.35,18.41 8.26,20.32 v9.14,20.32
TXO  (via drill 0.38)
  Top 0.203: v16,20.07 15.75,20.07 15.62,19.94 13.46,19.94 13.08,20.32 11.2,20.32 U5.21 9.68,21.84 8.64,21.84 8.22,22.26 R8.1 | v22.86,20.32 22.86,21.59 JP2.5
  Bottom 0.203: v16,20.07 22.61,20.07 v22.86,20.32
UCAP
  Top 0.203: U5.6 16.82,23.16 16.82,25.14 C8.2
USB_VCC  (via drill 0.38)
  Top 0.203: v8.89,41.91 10.16,40.64 SJ2.2 13.46,40.26 19.68,34.04 19.68,25.02 18.76,24.1 | 3.06,43.18 D4.A | 3.06,43.18 3.06,48.78 5.93,51.65 C9.1 | v5.08,43.18 3.06,43.18 | C11.2 18.59,23.95 18.59,22.17 U5.2 17.37,20.95 15.82,20.95 15.27,21.51 15.27,22.3 15.98,23.01 U5.7 | U1.4 9.59,51.75
  Top 0.254: X2.VBUS 10.19,59.91 11.18,58.93 11.18,58.67 v11.43,58.42
  Top 0.305: U1.4 10.16,51.78 | 7.62,53.34 JP6.2 | 7.62,53.34 8,53.34 9.59,51.75 | C9.1 6.35,52.83 6.86,53.34 7.62,53.34 | 18.76,24.1 18.76,23.9 C11.2
  Bottom 0.203: v8.89,41.91 6.35,41.91 v5.08,43.18
  Bottom 0.305: JP6.2 v11.43,58.42
VBATT  (via drill 0.38)
  Top 0.203: v12.7,52.7 12.7,51.78 U1.3 | R14.2 7.54,19.13 6.35,20.32 5.46,20.32 v5.33,20.45
  Top 0.305: U1.3 13.65,51.75 14.1,52.2 C1.A F1.1 19.18,52.2 20.32,53.34 JP14.2 20.05,54.88 JP3.2
  Bottom 0.203: v12.7,52.7 9.91,49.91 9.91,41.91 7.62,39.62 7.62,22.23 5.84,20.45 v5.33,20.45
VBATT_LVL
  Top 0.203: 10.91,18.65 U5.26 10.27,18 8.96,18 R14.1 8.89,17.62 8.27,17 7.98,17 R15.2

### Text on the board
Bottom: v31
tPlace: - | + | ASO | Power | CHG | ON | ON | OFF | RSSI | GND | 3V3 | Fio v3 | AREF | GND | 3V3 | D2 | RXI | D3 | ~ | TXO | D4 | RST | D5 | ~ | A5 | D6 | ~ | A4 | D7 | A3 | D8 | A2 | D9 | ~ | A1 | D10 | ~ | A0 | D11 | ~ | D14 | D17 | D16 | D15 | TX | RX
bPlace: 5V | - | DTR | CTS | - | + | CHG | BAT | 1 | SW | 3V3 | GND | GND | AREF | D2 | 3V3 | D3 | RXI | D4 | ~ | TXO | D5 | RST | D6 | ~ | A5 | D7 | ~ | A4 | D8 | A3 | D9 | A2 | D10 | ~ | A1 | D11 | ~ | A0 | ~ | D17 | D14 | D15 | D16
tValues: S. Kobayashi and N. Seidle | Toni Klopfenstein